# EAGLE design schematic_ap_team10 (EAGLE 8.6.1)
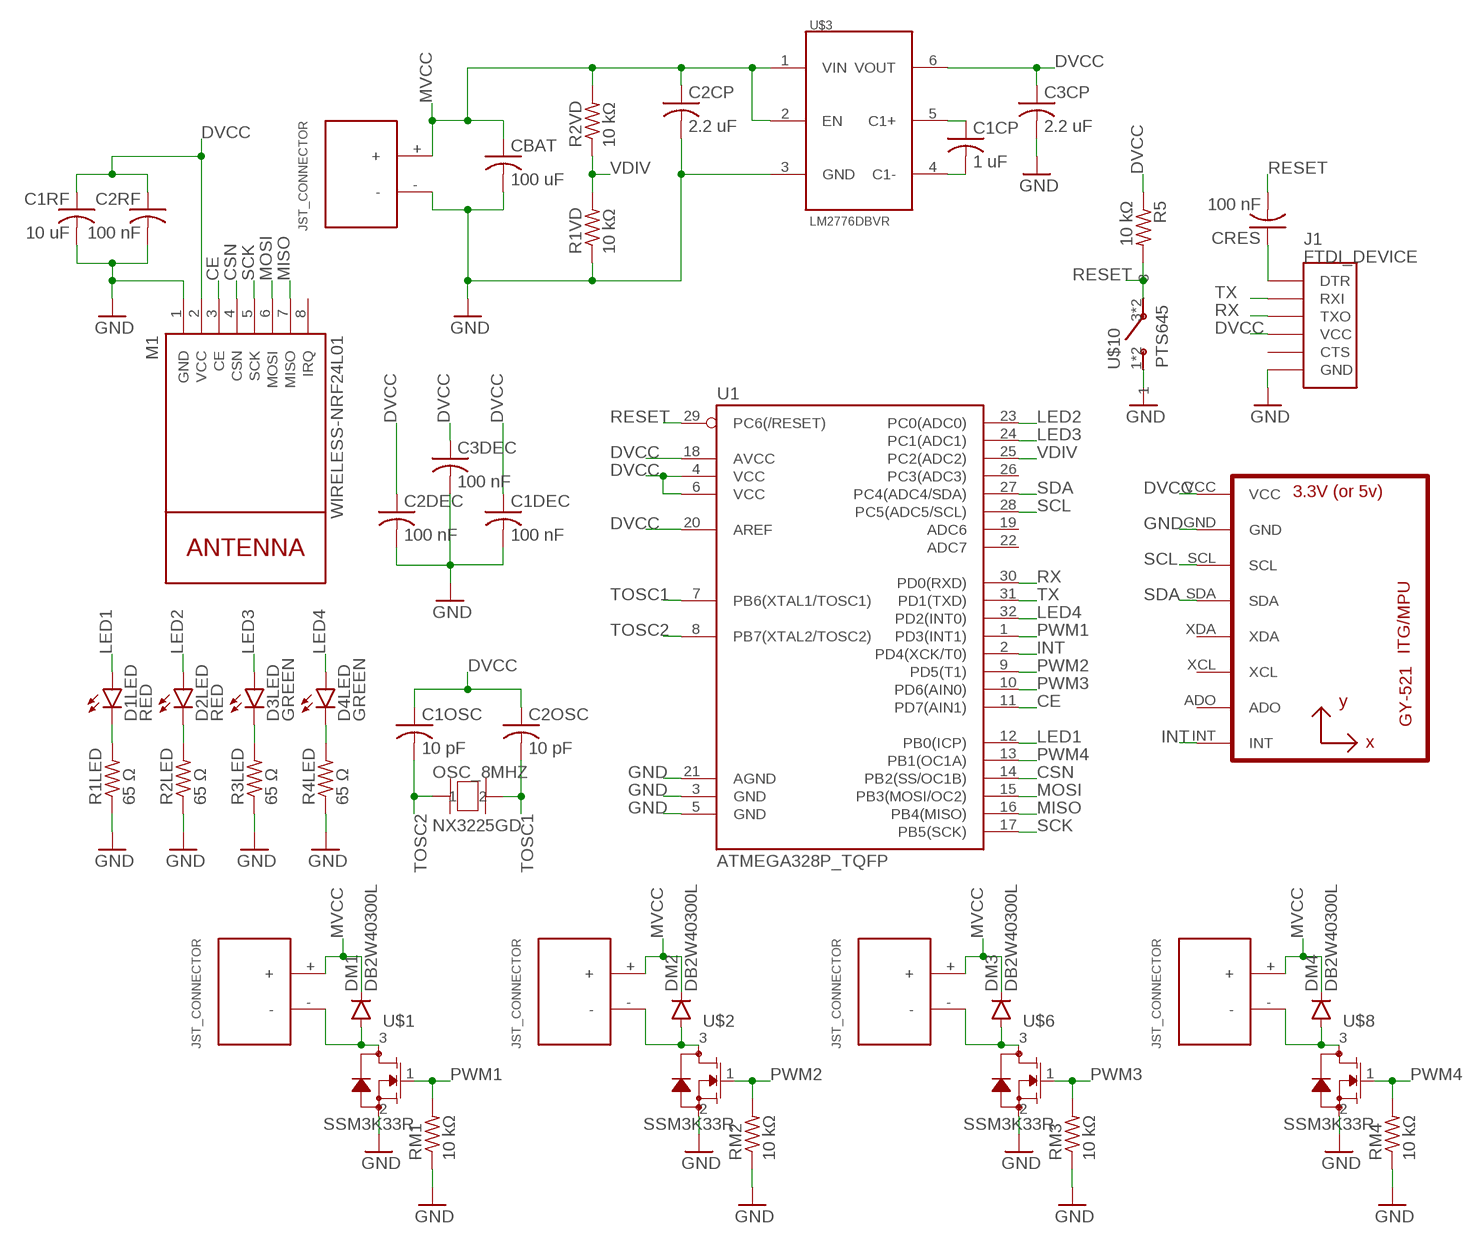
[diagram p0: schematic, sheet 1]

## Parts
C1CP  1 uF  C-USC0603  [C0603]
C1DEC  100 nF  C-USC0603  [C0603]
C1OSC  10 pF  C-USC0603  [C0603]
C1RF  10 uF  C-USC0603  [C0603]
C2CP  2.2 uF  C-USC0603  [C0603]
C2DEC  100 nF  C-USC0603  [C0603]
C2OSC  10 pF  C-USC0603  [C0603]
C2RF  100 nF  C-USC0603  [C0603]
C3CP  2.2 uF  C-USC0603  [C0603]
C3DEC  100 nF  C-USC0603  [C0603]
CBAT  100 uF  C-USC0805  [C0805]
CRES  100 nF  C-USC0603  [C0603]
D1LED  RED  LED-RED0603  [LED-0603]
D2LED  RED  LED-RED0603  [LED-0603]
D3LED  GREEN  LED-GREEN0603  [LED-0603]
D4LED  GREEN  LED-GREEN0603  [LED-0603]
DM1  DB2W40300L  [MINI2-F3-B]
DM2  DB2W40300L  [MINI2-F3-B]
DM3  DB2W40300L  [MINI2-F3-B]
DM4  DB2W40300L  [MINI2-F3-B]
J1  FTDI_DEVICE  [FTDI_DEVICE_SIDE]
M1  WIRELESS-NRF24L01  [WIRELESS-NRF24L01]
OSC_8MHZ  NX3225GD  [2-SMD]
R1LED  65 Ω  R-US_R0603  [R0603]
R1VD  10 kΩ  R-US_R0603  [R0603]
R2LED  65 Ω  R-US_R0603  [R0603]
R2VD  10 kΩ  R-US_R0603  [R0603]
R3LED  65 Ω  R-US_R0603  [R0603]
R4LED  65 Ω  R-US_R0603  [R0603]
R5  10 kΩ  R-US_R0603  [R0603]
RM1  10 kΩ  R-US_R0603  [R0603]
RM2  10 kΩ  R-US_R0603  [R0603]
RM3  10 kΩ  R-US_R0603  [R0603]
RM4  10 kΩ  R-US_R0603  [R0603]
U1  ATMEGA328P_TQFP  [TQFP32-08]
U2  GY-521MPU6050  [GY-521]
U$1  SSM3K33R  [SOT-23F]
U$2  SSM3K33R  [SOT-23F]
U$3  LM2776DBVR  [SOT23-5]
U$4  JST_CONNECTOR_FEMALE  [JST_CONNECTOR_FEMALE]
U$5  JST_CONNECTOR_FEMALE  [JST_CONNECTOR_FEMALE]
U$6  SSM3K33R  [SOT-23F]
U$7  JST_CONNECTOR_FEMALE  [JST_CONNECTOR_FEMALE]
U$8  SSM3K33R  [SOT-23F]
U$9  JST_CONNECTOR_FEMALE  [JST_CONNECTOR_FEMALE]
U$10  PTS645  [SOT-35]
U$11  JST_CONNECTOR_FEMALE  [JST_CONNECTOR_FEMALE]

## Nets
CE: M1.3(CE) U1.11(PD7(AIN1))
CSN: M1.4(CSN) U1.14(PB2(SS/OC1B))
DVCC: C1DEC.1 C1OSC.1 C1RF.1 C2DEC.1 C2OSC.1 C2RF.1 C3CP.1 C3DEC.1 J1.P$4(VCC) M1.2(VCC) R5.1 U1.4(VCC) U1.6(VCC) U1.18(AVCC) U1.20(AREF) U2.VCC U$3.6(VOUT)
GND: C1DEC.2 C1RF.2 C2CP.2 C2DEC.2 C2RF.2 C3CP.2 C3DEC.2 CBAT.2 J1.P$6(GND) M1.1(GND) R1LED.1 R1VD.1 R2LED.1 R3LED.1 R4LED.1 RM1.1 RM2.1 RM3.1 RM4.1 U1.3(GND) U1.5(GND) U1.21(AGND) U2.GND U$1.2 U$2.2 U$3.3(GND) U$6.2 U$8.2 U$10.1 U$10.2 U$11.-
INT: U1.2(PD4(XCK/T0)) U2.INT
LED1: D1LED.A U1.12(PB0(ICP))
LED2: D2LED.A U1.23(PC0(ADC0))
LED3: D3LED.A U1.24(PC1(ADC1))
LED4: D4LED.A U1.32(PD2(INT0))
MISO: M1.7(MISO) U1.16(PB4(MISO))
MOSI: M1.6(MOSI) U1.15(PB3(MOSI/OC2))
MVCC: C2CP.1 CBAT.1 DM1.NEG(GPIN) DM2.NEG(GPIN) DM3.NEG(GPIN) DM4.NEG(GPIN) R2VD.2 U$3.1(VIN) U$3.2(EN) U$4.+ U$5.+ U$7.+ U$9.+ U$11.+
N$1: DM1.POS(PPIN) U$1.3 U$4.-
N$2: DM2.POS(PPIN) U$2.3 U$5.-
N$3: CRES.1 J1.P$1(DTR)
N$4: DM3.POS(PPIN) U$6.3 U$7.-
N$5: DM4.POS(PPIN) U$8.3 U$9.-
N$12: C1CP.1 U$3.5(C1+)
N$13: C1CP.2 U$3.4(C1-)
N$19: D4LED.C R4LED.2
N$21: D2LED.C R2LED.2
N$23: D3LED.C R3LED.2
N$30: D1LED.C R1LED.2
PWM1: RM1.2 U1.1(PD3(INT1)) U$1.1
PWM2: RM2.2 U1.9(PD5(T1)) U$2.1
PWM3: RM3.2 U1.10(PD6(AIN0)) U$6.1
PWM4: RM4.2 U1.13(PB1(OC1A)) U$8.1
RESET: CRES.2 R5.2 U1.29(PC6(/RESET)) U$10.3 U$10.4
RX: J1.P$3(TXO) U1.30(PD0(RXD))
SCK: M1.5(SCK) U1.17(PB5(SCK))
SCL: U1.28(PC5(ADC5/SCL)) U2.SCL
SDA: U1.27(PC4(ADC4/SDA)) U2.SDA
TOSC1: C2OSC.2 OSC_8MHZ.2 U1.7(PB6(XTAL1/TOSC1))
TOSC2: C1OSC.2 OSC_8MHZ.1 U1.8(PB7(XTAL2/TOSC2))
TX: J1.P$2(RXI) U1.31(PD1(TXD))
VDIV: R1VD.2 R2VD.1 U1.25(PC2(ADC2))
Unconnected: J1.P$5(CTS) M1.8(IRQ) U1.19(ADC6) U1.22(ADC7) U1.26(PC3(ADC3)) U2.ADO U2.XCL U2.XDA

## Library data of the parts
C1CP C1DEC C1OSC C1RF C2CP C2DEC C2OSC C2RF C3CP C3DEC CBAT CRES = rcl:C-US: CAPACITOR, American symbol; SPICEPREFIX: C
D1LED D2LED = LEDs:LED-RED: Assorted Red LEDs LilyPad 1206- DIO-09912 1206- DIO-00809 0603- DIO-00819 "SMART" means more efficient and expensive; PROD_ID: DIO-00819
D3LED D4LED = LEDs:LED-GREEN: Various green LEDs Green LEDs used in SFE Production 0603- DIO-00821 LARGE- DIO-00862 LILYPAD- DIO-09910; PROD_ID: DIO-00821
DM1-DM4 = quad:DB2W40300L
J1 = quad:FTDI_DEVICE: Connector which mates to FTDI basic or FTDI cable.
M1 = quad:WIRELESS-NRF24L01: 2.4 GHz Wireless Module based on NRF24L01 chip
OSC_8MHZ = NX3225GD:NX3225GD
R1LED R1VD R2LED R2VD R3LED R4LED R5 RM1-RM4 = resistor:R-US_: RESISTOR, American symbol
U1 = quad:ATMEGA328P_TQFP; PROD_ID: IC-09069
U2 = quad:GY-521
U$1 U$2 U$6 U$8 = SSM3K33R:SSM3K33R
U$3 = LM2776:LM2776
U$4 U$5 U$7 U$9 U$11 = quad:JST_CONNECTOR_FEMALE
U$10 = PTS645:PTS645

## Board
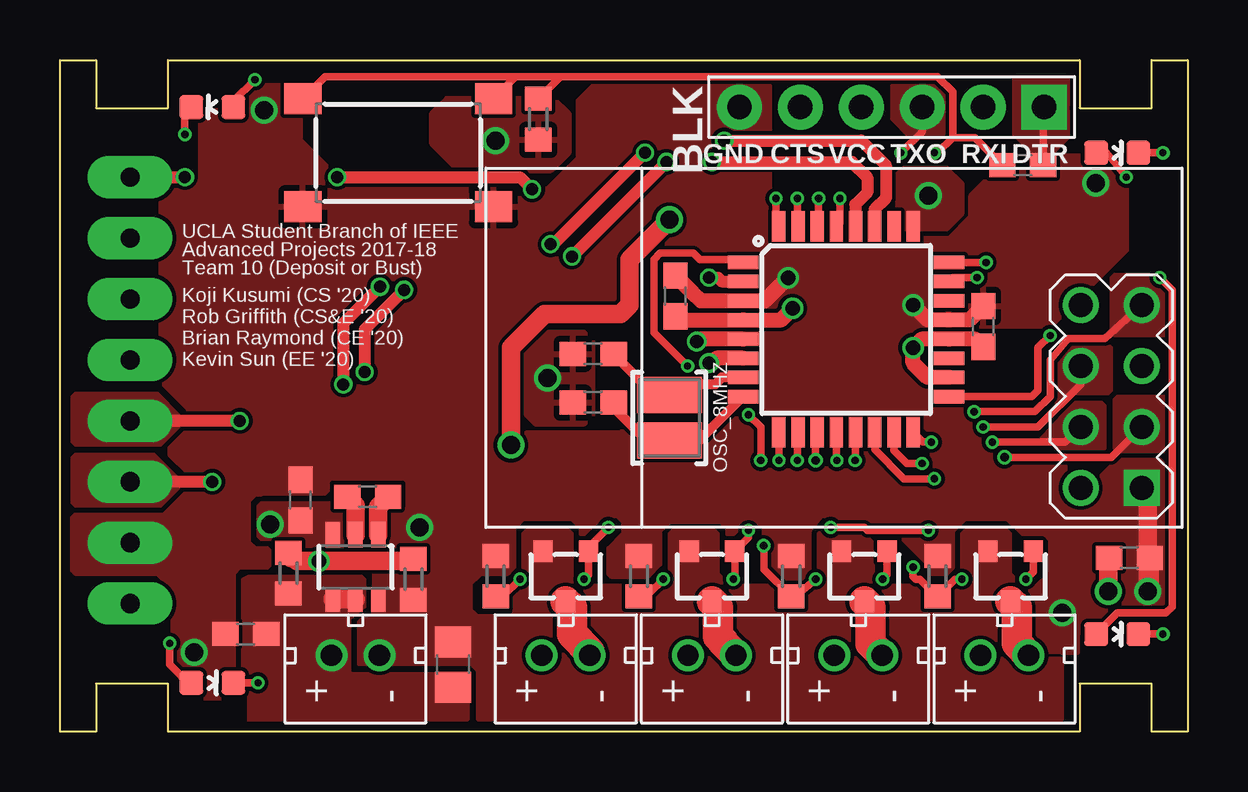
[diagram p1: board, top side]
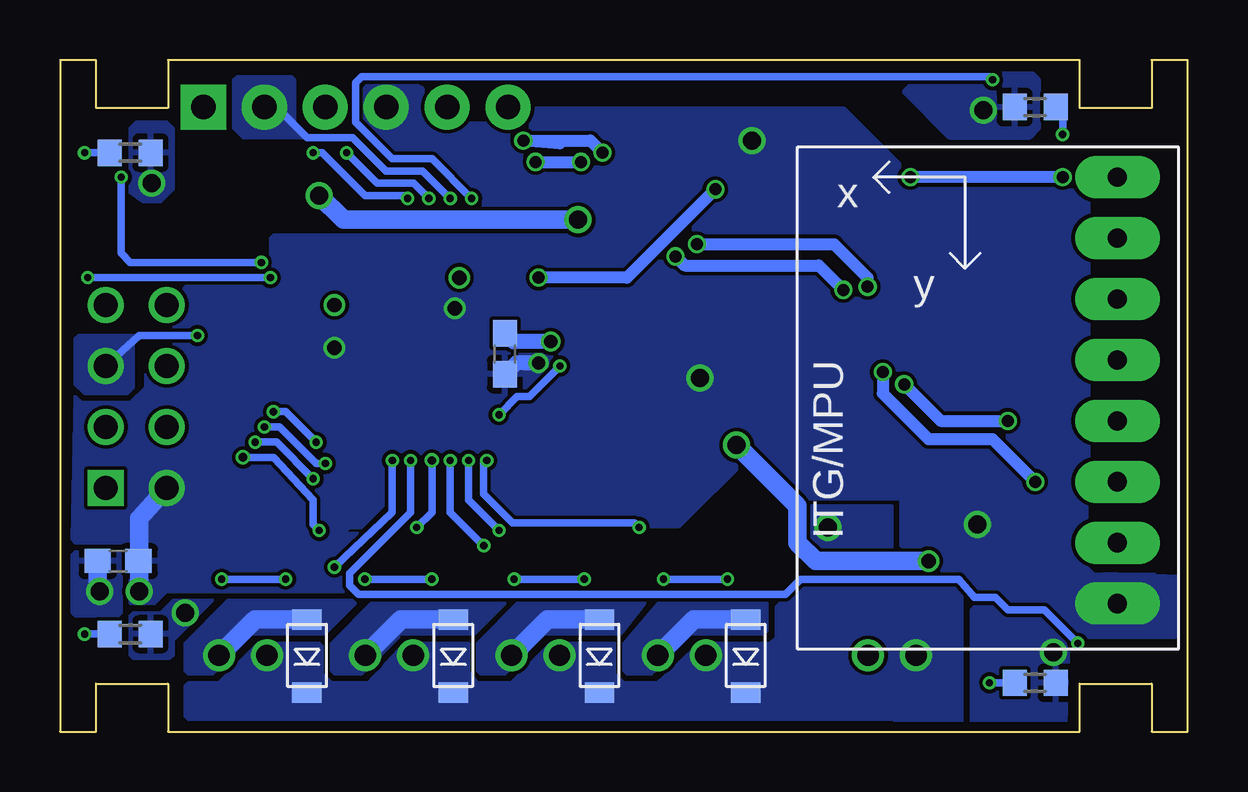
[diagram p2: board, bottom side, seen from below]

Size 47 x 28 mm. Coordinates in mm from the lower left corner, seen from the top.
Outline: 0,28 1.5,28 1.5,26 4.5,26 4.5,28 42.5,28 42.5,26 45.5,26 45.5,28 47,28 47,0 45.5,0 45.5,2 42.5,2 42.5,0 4.5,0 4.5,2 1.5,2 1.5,0 0,0 0,28
Copper layers (1*16): Top 0.035559375mm / dielectric 1.6mm / Bottom 0.035559375mm
Design rules "oshpark-2layer": minimum track width 6mil, minimum drill 10mil, track to track 6mil, track to pad 6mil, pad to pad 6mil, via to via 6mil, smd to smd 6mil, copper to edge 15mil, drill to drill 6mil, minimum pad ring 5mil, minimum via ring 5mil, stop-mask expansion 2.5mil, vias tented up to drill 0mil, thermal gap 10mil

### Footprints (pad centres in the part's own frame; a part is rotated, then mirrored left to right if it is on the bottom)
C0603 = smd 1.1 x 1: 1 -0.85,0; 2 0.85,0
C0805 = smd 1.3 x 1.5: 1 -0.95,0; 2 0.95,0
LED-0603 = smd 1 x 1: A 0,-0.877; C 0,0.877
MINI2-F3-B = smd 1.22 x 0.85: NEG 0,1.55; POS 0,-1.5
FTDI_DEVICE_SIDE = drill 1.016 pad 1.88 square: P$1 -6.35,0 | drill 1.016 pad 1.88: P$2 -3.81,0; P$3 -1.27,0; P$4 1.27,0; P$5 3.81,0; P$6 6.35,0
WIRELESS-NRF24L01 = drill 1 square: 1 -12.7,6.35 | drill 1: 2 -10.16,6.35; 3 -12.7,3.81; 4 -10.16,3.81; 5 -12.7,1.27; 6 -10.16,1.27; 7 -12.7,-1.27; 8 -10.16,-1.27
2-SMD = smd 1.5 x 2.7: 1 -0.95,0; 2 0.95,0
R0603 = smd 1 x 1.1: 1 -0.85,0; 2 0.85,0
TQFP32-08 = smd 1.27 x 0.559: 1 -4.293,2.8; 2 -4.293,2; 3 -4.293,1.2; 4 -4.293,0.4; 5 -4.293,-0.4; 6 -4.293,-1.2; 7 -4.293,-2; 8 -4.293,-2.8; 17 4.293,-2.8; 18 4.293,-2; 19 4.293,-1.2; 20 4.293,-0.4; 21 4.293,0.4; 22 4.293,1.2; 23 4.293,2; 24 4.293,2.8 | smd 0.559 x 1.27: 9 -2.8,-4.293; 10 -2,-4.293; 11 -1.2,-4.293; 12 -0.4,-4.293; 13 0.4,-4.293; 14 1.2,-4.293; 15 2,-4.293; 16 2.8,-4.293; 25 2.8,4.293; 26 2,4.293; 27 1.2,4.293; 28 0.4,4.293; 29 -0.4,4.293; 30 -1.2,4.293; 31 -2,4.293; 32 -2.8,4.293
GY-521 = drill 0.8 pad 1.778 long: ADO -8.89,-6.35; GND -8.89,6.35; INT -8.89,-8.89; SCL -8.89,3.81; SDA -8.89,1.27; VCC -8.89,8.89; XCL -8.89,-3.81; XDA -8.89,-1.27
SOT-23F = smd 0.8 x 0.9: 1 -0.95,-1.05; 2 0.95,-1.05; 3 0,1.05
SOT23-5 = smd 1.05 x 0.6: 1 -1.35,0.95; 2 -1.35,0; 3 -1.35,-0.95; 4 1.35,-0.95; 5 1.35,0; 6 1.35,0.95
JST_CONNECTOR_FEMALE = drill 0.889: + 0,1; - 0,-1
SOT-35 = smd 1.55 x 1.3: 1 -3.975,2.25; 2 3.975,2.25; 3 -3.975,-2.25; 4 3.975,-2.25

### Placement (x,y rotation side)
C1CP  12.83,9.78 0 top
C1DEC  38.48,16.89 90 top
C1OSC  22.23,13.72 0 top
C1RF  44.58,7.24 0 top
C2CP  7.75,4.06 180 top
C2DEC  25.65,18.16 90 top
C2OSC  22.23,15.75 0 top
C2RF  44.58,7.11 180 bottom
C3CP  10.03,9.65 90 top
C3DEC  28.45,15.75 90 bottom
CBAT  16.38,2.79 90 top
CRES  40.13,23.62 180 top
D1LED  6.35,2.03 270 top
D2LED  44.07,4.06 270 top
D3LED  44.07,24.13 270 top
D4LED  6.35,26.04 90 top
DM1  18.41,3.17 180 bottom
DM2  24.51,3.17 180 bottom
DM3  30.61,3.17 180 bottom
DM4  36.7,3.17 180 bottom
J1  34.67,26.04 180 top
M1  32.38,16.51 180 top
OSC_8MHZ  25.4,13.08 90 top
R1LED  6.35,2.03 180 bottom
R1VD  14.73,6.35 90 top
R2LED  44.07,4.06 180 bottom
R2VD  9.53,6.6 270 top
R3LED  44.07,24.13 180 bottom
R4LED  6.35,26.04 0 bottom
R5  19.94,25.53 90 top
RM1  18.16,6.48 270 top
RM2  24.13,6.48 270 top
RM3  30.48,6.48 270 top
RM4  36.58,6.48 270 top
U1  32.77,16.76 0 top
U2  11.81,14.22 180 bottom
U$1  21.08,6.48 180 top
U$2  27.18,6.48 180 top
U$3  12.32,6.86 90 top
U$4  21.08,3.17 90 top
U$5  27.18,3.17 90 top
U$6  33.53,6.48 180 top
U$7  33.27,3.17 90 top
U$8  39.62,6.48 180 top
U$9  39.37,3.17 90 top
U$10  14.1,24.13 180 top
U$11  12.32,3.17 90 top

### Tracks (layer width: path | path; a pad name or v marks a point on that pad's centre or on a via)
CE  (via drill 0.3, 0.35)
  Top 0.305: U1.11 31.5,12.4 v31.5,11.3 | M1.3 43.81,11.43 v39.37,11.43 | v32.13,8.51 33.53,8.51 33.66,8.38 v36.2,8.38
  Bottom 0.305: v32.13,8.51 31.5,9.14 v31.5,11.3 | v39.37,11.43 38.1,11.43 36.45,9.65 36.45,8.64 v36.2,8.38
  pour Top (no thermals): 44.07,13.97 46.1,13.97 46.23,13.84 46.23,11.81 46.1,11.68 44.07,11.68 43.94,11.81 43.94,13.84
CSN  (via drill 0.3)
  Top 0.305: M1.4 41.91,12.06 v38.86,12.06 | U1.14 33.97,11.75 35.18,10.54 v36.45,10.54
  Bottom 0.305: v36.45,10.54 37.97,12.06 v38.86,12.06
  pour Top (no thermals): 43.56,13.59 43.43,13.72 42.29,13.72 40.77,12.06 41.27,12.06 41.66,11.68 43.43,11.68 43.56,11.81
DVCC  (via drill 0.55, 0.6, 0.75)
  Top 0.635: C2DEC.1 26.05,17.16 U1.4 30.05,17.16 v30.54,17.65 | C1DEC.1 38.16,16.36 U1.20 35.92,16.36 v35.56,16 35.56,15.37 36.16,14.76 U1.18 | U1.6 27.38,15.56 27.18,15.37 v27.05,15.37
  Top 0.762: v43.69,5.84 43.69,7.2 C1RF.1
  Bottom 0.635: v27.05,15.37 27.98,15.37 C3DEC.1
  Bottom 0.762: C2RF.1 43.69,7.07 v43.69,5.84 43.69,8.89 M1.2
  other vias: 8.76,8.64 18.16,24.64 20.32,14.73
  pour Top (no thermals): 10.29,7.87 10.29,7.62 10.41,7.49 11.68,7.49 12.32,7.62 12.32,9.53 8.38,9.53 8.26,9.4 8.26,8.13 8.38,8 10.16,8
  pour Bottom: 11.68,7.62 11.94,7.75 11.94,10.03 6.86,10.03 6.86,11.3 5.33,9.78 4.19,9.78 4.19,7.75 8,7.62
  pour Bottom: 16.26,9.65 16.26,7.87 16.76,7.37 16.76,5.97 16.89,5.84 42.55,5.84 43.05,5.33 44.07,5.33 44.07,9.02 42.42,10.67 41.27,10.67 38.86,8.26 28.45,8.26 28.32,8.38 28.32,8.64 29.46,9.65 29.46,10.16 26.29,10.16 24,12.45 23.75,12.45 22.86,11.56 22.23,11.56 21.97,11.81 21.97,13.21 21.84,13.34 7.24,13.34 7.11,13.21 7.11,9.4 11.81,9.53 12.32,10.03 15.88,10.03
  pour Bottom: 0.38,6.48 0.38,4.06 0.51,3.94 4.83,3.94 6.22,5.33 7.37,5.33 7.87,5.84 8.76,5.84 9.53,6.6 10.29,6.6 10.29,7.37 10.54,7.62 10.79,7.62 9.78,8.64 9.02,8.64 8.51,9.14 4.19,9.14 4.19,6.86 3.81,6.48 3.43,6.6
  pour Bottom: 29.34,19.94 29.59,20.19 36.2,20.19 36.2,13.34 29.34,13.34
  pour Bottom: 44.2,7.87 46.35,7.87 46.48,8 46.35,13.97 46.1,13.72 44.07,13.72 43.43,14.35 43.43,16.76 41.4,18.92 38.35,18.8 38.23,18.92 38.23,20.57 38.1,20.7 23.5,20.7 23.37,20.57 23.37,11.05 23.75,10.67 33.02,10.67 33.15,10.54 33.15,9.78 34.42,8.51 34.92,8.51 36.45,6.99 37.72,6.99 38.86,8.13 43.94,8.13
  pour Top: 16.13,26.42 20.57,26.42 21.21,25.78 21.21,24.13 20.45,23.37 16.64,23.37 15.49,24.51 15.49,25.78
  pour Bottom (no thermals): 32.13,26.92 34.16,26.92 34.29,26.8 34.29,25.53 33.4,24.64 32,24.64 32,26.8
  pour Bottom (no thermals): 0.64,5.71 1.4,6.48 4.57,6.48 5.46,5.59 5.46,5.33 4.19,4.06 1.02,4.06 0.64,4.45
  pour Bottom: 4.19,9.78 4.19,23.24 11.68,23.24 14.35,25.91 27.43,25.91 28.83,25.27 29.97,25.27 32,26.8 33.15,26.8 34.54,25.4 34.54,25.15 33.15,23.75 31.5,23.75 28.32,20.57 25.53,20.57 23.75,18.8 23.75,16.38 29.46,10.67 29.46,9.91 28.19,8.64 21.21,8.64 18.41,11.43 16.64,9.78
  pour Bottom (no thermals): 41.4,10.67 42.04,11.3 43.05,11.3 43.69,10.67 43.69,9.65 43.05,9.02 42.04,9.02 41.4,9.65
  pour Top: 21.84,16.64 19.94,16.64 19.05,15.75 19.05,13.59 19.81,12.83 21.84,12.83 22.23,13.21 22.23,13.34 22.23,16.26
  pour Top (no thermals): 10.03,9.53 11.18,9.53 11.18,9.14 11.43,8.89 11.43,8.26 11.18,8 10.54,8 10.03,8.51
GND  (via drill 0.55, 0.6, 0.75)
  Top 0.305: 6.9,3.72 C2CP.2
  Top 0.635: C2DEC.2 26.33,18.33 26.35,18.33 26.72,17.96 U1.3 29.39,17.96 v30.35,18.92 | C1DEC.2 37.9,17.16 U1.21 36.18,17.16 v35.56,17.78 | U1.5 26.65,16.36 v26.54,16.26
  Top 0.762: C1RF.2 45.43,6.06 v45.34,5.84 45.34,9.78 M1.1
  Bottom 0.635: v26.54,16.26 28.11,16.26 C3DEC.2
  Bottom 0.762: C2RF.2 45.43,6.06 v45.34,5.84
  other vias: 14.99,8.51 41.78,4.95 43.18,22.86 5.59,3.3 8.51,25.91
  pour Top (no thermals): 13.08,4.95 13.08,9.27 17.14,9.27 17.14,4.83 15.62,4.83 17.78,2.54 17.91,0.51 17.4,2.79 12.45,2.79 12.45,4.57 12.57,4.7 12.83,4.7
  pour Bottom: 12.32,9.4 12.32,7.62 12.45,7.49 15.37,7.49 15.88,8 15.88,9.4
  pour Top (no thermals): 8.13,10.03 8.26,9.91 11.05,9.91 11.18,10.03 11.18,10.41 11.3,10.54 14.35,10.54 14.48,10.41 14.48,9.27 14.61,9.14 17.02,9.14 17.02,11.94 16.76,12.19 8.13,12.19
  pour Top: 17.4,4.83 17.02,5.21 16.89,5.21 16.64,4.95 16.64,2.92 16.76,2.79 17.14,2.79 17.4,2.54 17.4,0.51 17.53,0.38 41.66,0.38 41.78,0.51 41.78,3.05 40.89,3.05 40.26,3.81 19.05,3.68 18.92,3.81 18.92,4.7 18.8,4.83
  pour Top (no thermals): 18.8,4.83 18.92,4.95 18.92,5.71 19.3,6.1 19.3,8.26 19.43,8.38 21.21,8.38 21.34,8.26 21.34,6.6 21.84,6.1 25.27,6.1 25.4,6.22 25.4,8.26 25.53,8.38 27.3,8.38 27.43,8.26 27.43,6.6 27.94,6.1 31.5,6.1 31.62,6.22 31.62,8.26 31.75,8.38 33.4,8.38 33.91,7.87 33.91,6.22 34.04,6.1 37.47,6.1 37.59,6.22 37.59,8.26 37.72,8.38 39.5,8.38 39.62,8.26 39.62,6.6 40.13,6.1 41.66,6.1 41.78,5.97 41.78,3.3 18.92,3.3 18.8,3.43
  pour Top (no thermals): 9.02,12.19 5.84,12.19 5.59,11.94 5.59,9.02 0.64,9.02 0.51,8.89 0.51,6.73 0.64,6.6 4.06,6.6 4.7,5.97 4.7,2.41 4.83,2.29 4.83,1.52 4.95,1.4 7.11,1.4 7.24,1.65 7.24,6.6 7.49,6.86 8.64,6.86 8.76,6.99 8.76,7.49 8.64,7.62 8.13,7.62 7.87,7.87 7.87,9.02 7.49,9.02 7.37,9.14 8.13,9.91 8.38,9.91 8.89,10.41
  pour Top (no thermals): 29.34,19.94 29.59,20.19 36.2,20.19 36.2,13.34 29.34,13.34 29.34,16.13 28.45,16.13 28.45,16.64 29.34,16.64
  pour Bottom: 42.55,25.4 43.81,25.4 44.07,25.15 44.07,22.48 43.56,22.1 42.8,22.1 42.29,22.61 42.29,25.15
  pour Bottom: 4.95,3.56 6.22,4.83 7.75,4.83 8.13,5.21 8.89,5.21 9.02,5.08 9.02,0.38 8.89,0.25 5.21,0.25 5.08,0.38
  pour Top: 9.91,26.8 9.53,26.8 9.27,26.92 7.87,26.92 7.11,25.91 7.11,26.29 5.84,25.53 5.84,22.99 7.11,22.99 8.64,21.46 8.64,21.08 9.02,20.7 11.05,20.7 11.68,21.34 11.68,22.99 10.03,24.64 10.03,26.67
  pour Bottom: 11.05,27.43 6.48,27.43 6.22,27.18 6.22,25.15 6.6,24.77 9.91,24.77 11.81,26.67
  pour Top (no thermals): 19.43,12.45 16.76,10.03 16.76,6.6 17.02,6.1 17.53,6.6 18.67,6.6 18.92,6.86 18.92,8.51 19.3,8.89 21.34,8.89 21.72,8.51 21.72,8.26 21.84,8.26 22.61,9.02 23.24,9.02 23.5,8.76 23.5,8.26 22.86,7.62 22.86,6.6 22.99,6.48 24.51,6.48 25.02,6.99 25.02,8.38 25.4,8.76 27.56,8.76 27.81,8.51 27.81,8.26 28.07,8.26 28.19,8.38 28.19,8.64 28.45,8.89 28.96,8.89 29.34,8.51 29.34,6.86 30.23,5.97 30.86,5.97 31.24,6.35 31.24,8.38 31.75,9.02 32.26,9.02 32.77,8.51 34.67,8.51 36.2,6.99 36.32,6.6 36.96,6.6 37.21,6.86 37.21,8.38 37.72,8.89 39.5,8.89 40.13,8.26 41.02,8.26 41.27,8 41.27,6.6 40.64,5.97 40.64,4.45 41.78,3.3 42.42,3.3 42.42,4.06 42.67,4.32 43.43,4.32 43.94,4.83 45.47,4.83 45.97,5.33 45.97,11.18 45.85,11.3 44.07,11.3 43.18,10.41 43.18,9.91 42.93,9.65 42.16,9.65 41.91,9.91 41.91,11.05 41.78,11.18 41.53,11.18 41.15,11.43 40.01,11.43 37.47,13.97 36.32,13.97 35.69,13.34 35.43,13.34 36.45,12.32 36.45,11.81 35.81,11.3 35.31,11.3 34.54,12.06 29.97,12.06 29.97,13.97 24.38,13.97 23.37,12.45
  pour Top (no thermals): 29.59,24.64 29.59,26.92 29.21,27.3 26.92,27.3 26.16,26.54 26.16,25.02 27.3,23.88 28.83,23.88
  pour Top: 29.59,22.35 29.59,26.92 29.21,27.3 22.61,27.3 21.59,26.29 21.59,23.88 20.32,22.61 19.68,22.61 19.18,22.99 4.45,22.99 4.19,22.73 4.19,14.61 5.33,13.46 5.33,12.57 4.57,11.81 4.57,11.56 5.33,10.79 5.33,10.03 4.32,9.02 4.83,8.51 7.37,8.51 7.87,9.02 7.87,9.65 9.02,10.79 9.02,11.18 9.4,11.56 14.86,11.56 16.26,10.16 16.89,10.16 17.53,10.67 19.43,12.45 19.18,12.7 19.05,12.7 19.05,12.83 18.67,13.21 18.67,16 19.94,17.14 23.62,17.14 23.75,17.27 23.75,19.56 25.53,21.34 25.53,21.21 25.02,20.7 25.02,20.07 25.15,19.94 26.42,19.94 26.67,19.68 29.34,19.68 30.1,20.45 30.1,21.46 29.97,21.59 29.84,22.1
  pour Top: 35.69,20.19 36.07,20.57 37.08,20.57 37.97,21.46 37.97,22.35 38.99,23.37 41.78,23.37 41.78,24 43.56,24 44.45,23.11 44.45,20.07 41.27,16.89 36.7,16.89 35.69,17.91
  pour Top (no thermals): 15.11,4.19 15.75,4.83 17.4,4.83 17.4,2.79 15.11,2.79
  pour Top (no thermals): 12.45,3.81 12.45,2.79 14.35,2.79 14.61,3.05 14.61,3.68 13.97,4.32 12.95,4.32
  pour Top (no thermals): 13.97,6.35 15.49,6.35 15.75,6.1 15.75,4.83 15.49,4.57 13.97,4.57 13.84,4.7 13.84,6.22
  pour Bottom: 40.64,5.46 42.29,5.46 42.55,5.21 42.8,4.95 43.18,4.95 43.94,4.95 44.07,4.83 44.07,3.17 43.94,3.05 42.42,3.05 42.29,3.17 42.29,3.81 42.16,3.94
  pour Bottom: 44.45,7.37 44.58,7.49 46.35,7.49 46.48,7.37 46.48,4.95 46.35,4.83 44.58,4.83 44.45,4.95
INT  (via drill 0.5)
  Top 0.508: v19.68,22.61 19.18,23.11 v11.56,23.11 | v27.05,18.92 27.43,18.92 27.59,18.76 U1.2 | U2.INT v5.21,23.11
  Bottom 0.508: v19.68,22.61 23.37,18.92 v27.05,18.92 | v5.21,23.11 v11.56,23.11
LED1  (via drill 0.3)
  Top 0.305: v32.38,11.3 32.37,11.41 U1.12 | D1LED.A 5.47,1.89 4.57,2.79 v4.57,3.68
  Bottom 0.305: v4.57,3.68 5.97,5.08 7.49,5.08 8,5.59 8.89,5.59 9.53,6.35 16.13,6.35 16.76,5.71 34.54,5.71 34.92,6.1 34.92,6.6 32.38,9.14 v32.38,11.3
LED2  (via drill 0.3)
  Top 0.305: D2LED.A 44.08,4.95 46.1,4.95 46.35,5.21 46.35,18.41 v45.85,18.92 | v38.23,18.92 37.22,18.92 U1.23
  Bottom 0.305: v45.85,18.92 v38.23,18.92
LED3  (via drill 0.3)
  Top 0.305: D3LED.A 43.43,24.38 v44.45,23.11 | U1.24 v38.61,19.56
  Bottom 0.305: v44.45,23.11 44.45,19.94 44.07,19.56 v38.61,19.56
LED4  (via drill 0.3)
  Top 0.305: v29.84,22.23 29.84,21.18 U1.32 | v8.13,27.18 7.23,26.28 D4LED.A
  Bottom 0.305: v8.13,27.18 8.26,27.3 34.42,27.3 34.67,27.05 34.67,25.4 33.15,23.88 31.5,23.88 v29.84,22.23
MISO  (via drill 0.3)
  Top 0.305: M1.7 43.56,16.38 42.04,16.38 41.27,15.49 41.27,13.97 40.64,13.34 v38.1,13.34 | v36.32,12.06 35.97,12.06 U1.16
  Bottom 0.305: v36.32,12.06 37.59,13.34 v38.1,13.34
  pour Top (no thermals): 43.94,19.05 45.72,19.05 46.35,18.41 46.35,16.64 46.23,16.51 43.94,16.51 43.81,16.64 43.81,18.92
MOSI  (via drill 0.3)
  Top 0.305: M1.6 42.55,14.48 40.77,12.7 v38.48,12.7 | U1.15 34.77,11.72 35.31,11.18 v35.94,11.18
  Bottom 0.305: v35.94,11.18 36.32,11.18 37.85,12.7 v38.48,12.7
  pour Top (no thermals): 42.04,16.38 43.43,16.38 43.81,16 43.81,14.22 43.69,14.1 42.16,14.1 41.53,13.46 41.53,15.88
MVCC
  Top 0.762: U$3.1 U$3.2
  pour Bottom: 12.06,0.25 12.19,0.38 12.19,5.97 12.06,6.1 9.53,6.1 9.4,5.97 9.4,0.38 9.53,0.25
  pour Top (no thermals): 7.87,6.48 12.57,6.48 12.7,6.35 12.7,5.21 12.06,4.7 12.06,2.29 11.94,2.16 7.87,2.16 7.62,2.29 7.62,6.35
  pour Top: 11.94,2.54 12.19,2.41 16.89,2.41 17.02,2.16 17.02,0.51 16.89,0.38 7.87,0.38 7.87,2.41 8,2.54
  pour Bottom (no thermals): 41.66,2.03 41.78,1.91 41.78,0.64 41.66,0.51 17.91,0.51 17.78,0.64 17.78,3.56 17.91,3.68 20.32,3.68 22.1,2.03 23.5,2.03 23.88,2.41 23.88,3.68 26.54,3.68 28.19,2.03 29.59,2.03 29.97,2.54 29.97,3.68 32.64,3.68 34.16,2.03 35.69,2.03 36.07,2.41 36.07,3.56 36.2,3.68 38.73,3.68 40.39,2.03
  pour Bottom (no thermals): 17.78,3.68 17.4,3.68 17.14,3.94 17.14,5.21 16.89,5.46 16.64,5.46 16.38,5.71 16.38,6.1 16.26,6.22 12.19,6.22 12.19,2.67 11.81,2.29 11.81,0.51 17.91,0.51
  pour Top (no thermals): 12.06,3.94 12.06,2.29 11.94,2.16 10.79,2.16 10.29,2.67 10.29,3.68 10.79,4.19 11.43,4.19 11.81,4.19
  pour Bottom (no thermals): 10.79,4.06 11.68,4.06 12.19,3.56 12.19,2.67 11.68,2.16 11.05,2.16 10.29,2.92 10.29,3.05 10.29,3.56
  pour Bottom (no thermals): 19.18,3.68 20.32,3.68 21.08,2.92 21.08,2.67 20.7,2.29 20.57,2.16 19.81,2.16 19.68,2.16 19.3,2.54 19.05,2.79 19.05,3.43 19.05,3.56
  pour Bottom (no thermals): 25.27,3.68 26.54,3.68 27.18,3.05 27.18,2.54 26.8,2.16 25.78,2.16 25.4,2.54 25.15,2.79 25.15,3.56
  pour Bottom (no thermals): 31.5,3.68 32.51,3.68 33.27,2.92 33.27,2.54 32.89,2.16 31.75,2.16 31.5,2.41 31.24,2.67 31.24,3.43
  pour Bottom (no thermals): 37.47,3.68 38.73,3.68 39.5,2.92 39.5,2.79 38.99,2.29 38.86,2.16 37.85,2.16 37.34,2.67 37.34,2.92 37.34,3.56
  pour Top (no thermals): 8.64,6.48 10.41,6.48 10.54,6.35 10.41,4.95 9.53,4.06 9.53,3.3 9.27,3.05 7.87,3.05 7.75,3.17 7.75,5.59
  pour Top (no thermals): 15.24,2.41 17.02,2.41 17.02,0.51 15.49,0.51 15.24,0.76
N$1
  Top 1.27: U$4.- 22.08,3.32 21.34,4.06 21.34,5.17 U$1.3
  Bottom 0.762: DM1.POS 20.58,4.67 U$4.-
  pour Bottom (no thermals): 21.97,5.46 20.7,5.46 20.7,4.06 22.35,2.41 23.37,2.41 23.5,2.54 23.5,3.68
  pour Bottom (no thermals): 21.08,4.06 21.08,5.46 17.65,5.46 17.53,5.33 17.53,4.19 17.65,4.06
N$2
  Top 1.27: U$5.- 27.63,3.72 27.63,3.78 27.43,3.98 27.43,5.17 U$2.3
  Bottom 0.762: DM2.POS 26.68,4.67 U$5.-
  pour Bottom (no thermals): 26.8,4.06 26.8,5.46 27.81,5.46 29.59,3.68 29.59,2.54 29.46,2.41 28.45,2.41
  pour Bottom (no thermals): 22.61,5.33 22.73,5.46 27.18,5.46 27.18,4.06 23.62,4.06
N$3
  Top 0.305: J1.P$1 40.98,26 CRES.1
  pour Top (no thermals): 39.88,27.3 41.91,27.3 42.04,27.18 42.04,24.77 41.4,24.13 40.51,24.13 39.75,24.89 39.75,27.18
N$4
  Top 1.27: U$7.- 33.78,3.67 33.78,5.17 U$6.3
  Bottom 0.762: DM3.POS 32.77,4.67 U$7.-
  pour Bottom (no thermals): 32.89,3.94 32.89,5.46 33.91,5.46 35.69,3.68 35.69,2.54 35.56,2.41 34.42,2.41
  pour Bottom (no thermals): 28.45,5.33 28.57,5.46 33.27,5.46 33.27,4.06 29.72,4.06
N$5
  Top 1.27: U$9.- 39.88,3.67 39.88,5.17 U$8.3
  Bottom 0.762: DM4.POS 38.87,4.67 U$9.-
  pour Bottom (no thermals): 38.99,4.06 38.99,5.46 40.01,5.46 41.78,3.68 41.78,2.54 41.66,2.41 40.64,2.41
  pour Bottom (no thermals): 34.67,5.33 34.8,5.46 39.5,5.46 39.5,4.06 35.94,4.06
N$12
  Top 0.762: U$3.5 12.32,9.44 C1CP.1
N$13
  Top 0.762: U$3.4 13.27,9.37 C1CP.2
N$19  (via drill 0.3)
  Top 0.305: v5.21,24.89 5.21,26.17 D4LED.C
  Bottom 0.305: R4LED.2 5.21,26.2 v5.21,24.89
N$21  (via drill 0.3)
  Top 0.305: v45.97,4.06 D2LED.C
  Bottom 0.305: R2LED.2 v45.97,4.06
N$23  (via drill 0.3)
  Top 0.305: D3LED.C v45.97,24.13
  Bottom 0.305: v45.97,24.13 R3LED.2
N$30  (via drill 0.3)
  Top 0.305: v8.26,2.03 D1LED.C
  Bottom 0.305: R1LED.2 v8.26,2.03
PWM1  (via drill 0.3)
  Top 0.305: RM1.2 18.45,5.63 v19.18,6.35 | v21.84,6.35 22.03,6.54 U$1.1 22.03,7.68 v22.86,8.51 | U1.1 28.35,19.68 26.67,19.68 26.42,19.94 25.02,19.94 24.77,19.68 24.77,16.64 v26.16,15.24 | v29.21,11.3 29.21,12.7 v28.7,13.21
  Bottom 0.305: v19.18,6.35 v21.84,6.35 | v22.86,8.51 23.05,8.7 28.13,8.7 29.34,9.91 29.34,11.18 v29.21,11.3 | v28.7,13.21 27.94,13.97 27.43,13.97 v26.16,15.24
PWM2  (via drill 0.3)
  Top 0.305: RM2.2 24.55,5.75 v25.15,6.35 | v28.07,6.35 28.13,6.41 U$2.1 28.7,8.1 v28.7,8.38 | v29.97,11.3 29.97,11.55 U1.9
  Bottom 0.305: v25.15,6.35 v28.07,6.35 | v29.97,11.3 29.97,9.65 v28.7,8.38
PWM3  (via drill 0.3)
  Top 0.305: v31.5,6.35 30.65,5.63 RM3.2 29.34,6.77 v29.34,7.75 | v34.29,6.35 34.48,6.54 U$6.1 | v30.73,11.3 30.73,12.44 U1.10
  Bottom 0.305: v31.5,6.35 v34.29,6.35 | v29.34,7.75 30.73,9.14 v30.73,11.3
PWM4  (via drill 0.3)
  Top 0.305: v40.26,6.35 40.57,6.67 U$8.1 | U1.13 33.17,11.7 v33.15,11.3 | v35.56,6.86 35.56,6.48 35.69,6.35 35.85,6.35 RM4.2 37.3,6.35 v37.59,6.35
  Bottom 0.305: v37.59,6.35 v40.26,6.35 | v35.56,6.86 33.15,9.14 v33.15,11.3
RESET  (via drill 0.3)
  Top 0.305: 32.26,20.78 U1.29 32.51,21.2 v32.51,22.23 | U$10.4 11.05,27.3 19,27.3 | 19,27.3 20.87,27.3 | 20.87,27.3 36.58,27.3 37.21,26.67 37.21,24.77 | U$10.3 19,27.3 | R5.2 20.87,27.3 | 37.21,24.77 36.58,24.13 v36.45,24.13 | CRES.2 38.14,24.77 37.21,24.77
  Bottom 0.305: v36.45,24.13 36.07,24.13 34.29,22.35 32.64,22.35 v32.51,22.23
RX  (via drill 0.3)
  Top 0.305: J1.P$3 35.94,25.02 v35.05,24.13 | v31.62,22.23 31.62,21.11 U1.30
  Bottom 0.305: v35.05,24.13 33.78,22.86 32.26,22.86 v31.62,22.23
  pour Top (no thermals): 36.58,27.3 37.21,26.67 37.21,25.27 36.7,24.77 35.43,24.77 34.67,25.53 34.67,26.92 35.05,27.3
SCK  (via drill 0.3)
  Top 0.305: v41.27,16.51 40.77,16 40.77,14.22 40.51,13.96 U1.17
  Bottom 0.305: M1.5 43.69,16.51 v41.27,16.51
  pour Bottom (no thermals): 45.97,14.1 46.35,14.48 46.35,16.38 46.23,16.51 43.81,16.51 43.94,16.38 43.94,14.35 44.2,14.1
SCL  (via drill 0.5)
  Top 0.508: v27.18,23.75 33.02,23.75 33.66,23.11 33.66,22.48 33.15,21.97 33.15,21.08 U1.28 | v25.27,23.75 v21.34,19.81 | v14.35,18.41 12.7,16.76 v12.7,14.99 | v6.35,10.41 U2.SCL
  Bottom 0.508: v21.34,19.81 20.95,19.43 15.37,19.43 v14.35,18.41 | v27.18,23.75 v25.27,23.75 | v12.7,14.99 12.7,14.1 10.79,12.19 8.13,12.19 v6.35,10.41
  pour Top (no thermals): 4.19,9.4 4.95,10.16 4.95,10.54 3.94,11.56 0.64,11.56 0.51,11.43 0.51,9.53 0.64,9.4
SDA  (via drill 0.5)
  Top 0.508: U1.27 33.97,21.77 34.42,22.23 34.42,23.62 33.4,24.64 v27.69,24.64 | v24.38,24.13 20.57,20.32 v20.45,20.32 | v13.34,18.54 11.81,17.02 v11.81,14.48 | v7.49,12.95 U2.SDA
  Bottom 0.508: 26.16,24.51 v27.69,24.64 24.89,24.64 v24.38,24.13 | v20.45,20.32 14.73,20.32 13.34,18.92 v13.34,18.54 | v11.81,14.48 10.29,12.95 v7.49,12.95
  pour Top (no thermals): 0.51,12.06 0.64,11.94 4.19,11.94 4.95,12.7 4.95,13.21 4.06,14.1 0.64,14.1 0.51,13.97
TOSC1
  Top 0.406: U1.7 27.59,14.76 27.3,14.48 25.85,14.48 OSC_8MHZ.2 25.21,14.22 24.6,14.22 C2OSC.2
TOSC2
  Top 0.406: 25.21,11.94 OSC_8MHZ.1 | U1.8 26.64,12.13 OSC_8MHZ.1 | OSC_8MHZ.1 24.45,12.13 23.07,13.5 C1OSC.2
TX  (via drill 0.3)
  Top 0.305: v30.73,22.23 30.73,21.09 U1.31
  Bottom 0.305: v30.73,22.23 31.88,23.37 33.4,23.37 34.8,24.77 36.7,24.77 37.97,26.04 J1.P$2
  pour Bottom (no thermals): 37.21,27.18 37.34,27.3 39.62,27.3 39.75,27.18 39.75,25.15 39.37,24.77 36.58,24.77 37.21,25.4
VDIV  (via drill 0.6, 0.75)
  Top 0.762: R1VD.2 14.61,7.33 14.39,7.11 v10.79,7.11 9.87,7.11 R2VD.1 9.61,7.24 | v25.4,21.34 23.75,19.68 23.75,17.78 23.37,17.4 20.19,17.4 18.8,16 v18.8,11.94
  Bottom 0.762: v18.8,11.94 16.26,9.4 16.26,7.87 15.49,7.11 v10.79,7.11 | v25.4,21.34 35.18,21.34 v36.2,22.35
  pour Top (no thermals): 36.96,20.95 34.92,20.95 34.92,23.24 35.18,23.5 36.96,23.5 37.59,22.86 37.59,21.59

### Text on the board
tPlace: UCLA Student Branch of IEEE | Advanced Projects 2017-18 | Team 10 (Deposit or Bust) | Koji Kusumi (CS '20) | Rob Griffith (CS&E '20) | Brian Raymond (CE '20) | Kevin Sun (EE '20)